# EAGLE design magchess2 (EAGLE 9.3.0)
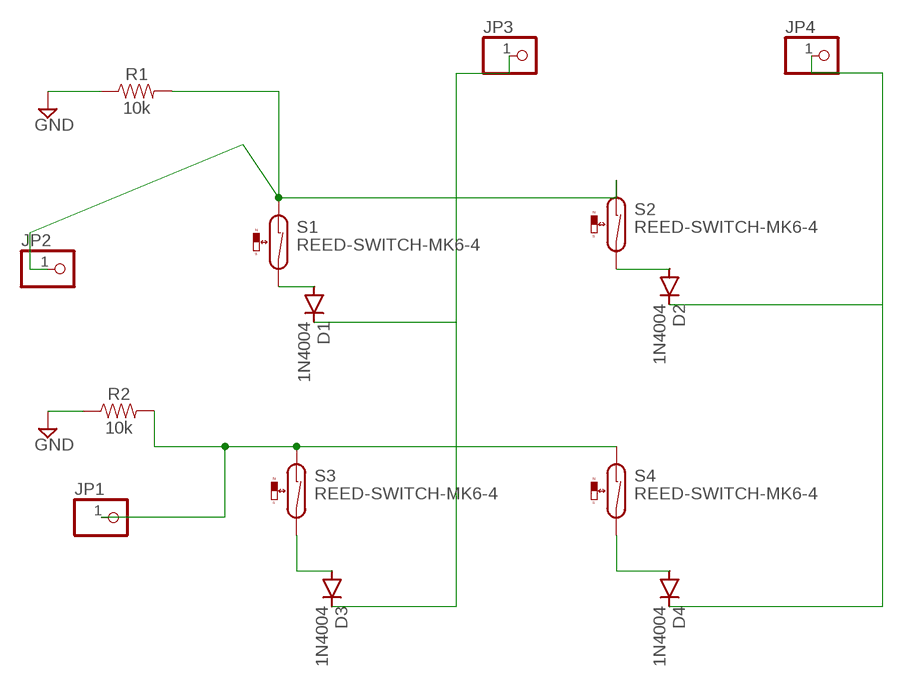
[diagram p0: schematic, sheet 1]

## Parts
D1  1N4004  [DO41-10]
D2  1N4004  [DO41-10]
D3  1N4004  [DO41-10]
D4  1N4004  [DO41-10]
JP1  PINHD-1X1  [1X01]
JP2  PINHD-1X1  [1X01]
JP3  PINHD-1X1  [1X01]
JP4  PINHD-1X1  [1X01]
R1  10k  10KOHM-HORIZ-1/4W-5%  [AXIAL-0.3]
R2  10k  10KOHM-HORIZ-1/4W-5%  [AXIAL-0.3]
S1  REED-SWITCH-MK6-4  [MK6-4]
S2  REED-SWITCH-MK6-4  [MK6-4]
S3  REED-SWITCH-MK6-4  [MK6-4]
S4  REED-SWITCH-MK6-4  [MK6-4]

## Nets
GND: R1.P$1 R2.P$1
N$1: JP2.1 R1.P$2 S1.1 S2.1
N$2: JP1.1 R2.P$2 S3.1 S4.1
N$3: D1.A S1.2
N$4: D3.A S3.2
N$5: D4.A S4.2
N$6: D2.A S2.2
N$7: D2.C D4.C JP4.1
N$8: D1.C D3.C JP3.1

## Library data of the parts
D1-D4 = diode:1N4004: DIODE general purpose rectifier, 1 A
JP1-JP4 = pinhead:PINHD-1X1: PIN HEADER
R1 R2 = SparkFun-Resistors:10KOHM: 10kΩ resistor A resistor is a passive two-terminal electrical component that implements electrical resistance as a circuit element. Resistors act to reduce current flow, and, at the same time, act to lower voltage levels within circuits. - Wikipedia; PROD_ID: RES-09435
S1-S4 = switch-reed:REED-SWITCH-: Reed Sensor; OC_FARNELL: unknown

## Net classes
0 default: width 0.406 mm, clearance 0.406 mm

## Board
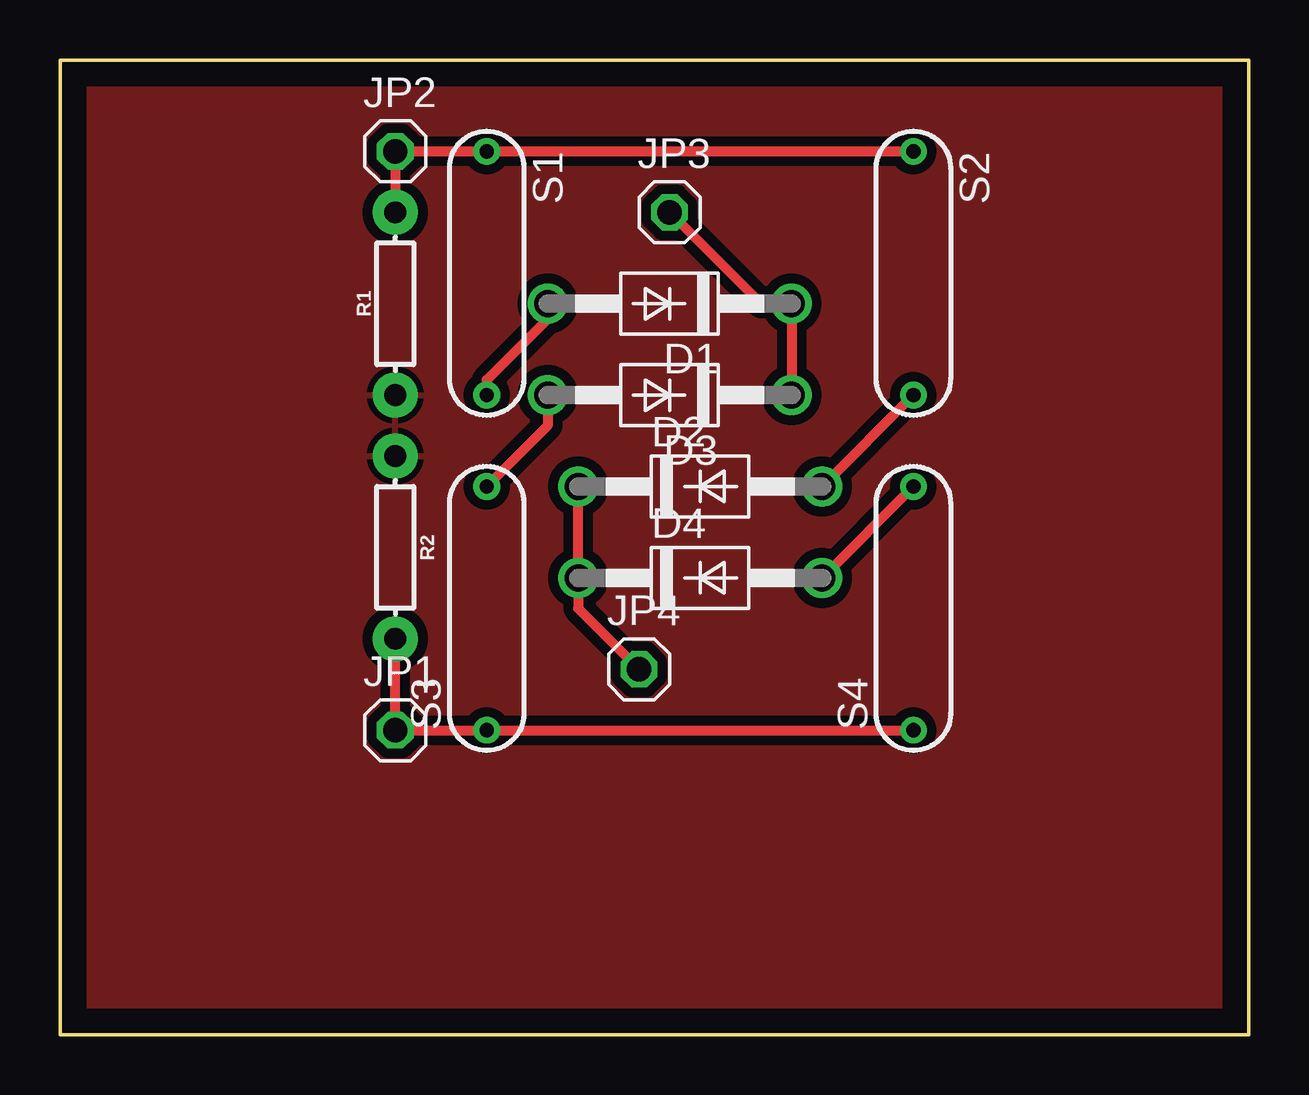
[diagram p1: board, top side]

Size 49.53 x 40.64 mm. Coordinates in mm from the lower left corner, seen from the top.
Outline: 0,40.64 49.53,40.64 49.53,0 0,0 0,40.64
Copper layers (1*16): Top 0.035mm / dielectric 1.5mm / Bottom 0.035mm
Design rules "default *": minimum track width 6mil, minimum drill 0.35mm, track to track 12mil, track to pad 12mil, pad to pad 12mil, via to via 12mil, smd to smd 6mil, copper to edge 40mil, drill to drill 12mil, minimum pad ring 10mil, minimum via ring 8mil, stop-mask expansion 4mil, vias tented up to drill 0mil, thermal gap 10mil

### Footprints (pad centres in the part's own frame; a part is rotated, then mirrored left to right if it is on the bottom)
DO41-10 = drill 1.118: A 5.08,0; C -5.08,0
1X01 = drill 1.016 octagon: 1 0,0
AXIAL-0.3 = drill 0.9 pad 1.88: P$1 -3.81,0; P$2 3.81,0
MK6-4 = drill 0.6 pad 1.016: 1 -5.08,0; 2 5.08,0

### Placement (x,y rotation side)
D1  25.4,30.48 180 top
D2  26.67,22.86 0 top
D3  25.4,26.67 180 top
D4  26.67,19.05 0 top
JP1  13.97,12.7 0 top
JP2  13.97,36.83 0 top
JP3  25.4,34.29 0 top
JP4  24.13,15.24 0 top
R1  13.97,30.48 90 top
R2  13.97,20.32 270 top
S1  17.78,31.75 270 top
S2  35.56,31.75 270 top
S3  17.78,17.78 90 top
S4  35.56,17.78 90 top

### Tracks (layer width: path | path; a pad name or v marks a point on that pad's centre or on a via)
GND
  pour Top: -11.43,59.69 -11.43,-8.89 66.04,-8.89 66.04,57.15 0,57.15 0,59.69
N$1
  Top 0.406: S2.1 S1.1 JP2.1 R1.P$2
N$2
  Top 0.406: S4.1 S3.1 JP1.1 R2.P$2
N$3
  Top 0.406: S1.2 17.78,27.3 20.32,29.84 D1.A
N$4
  Top 0.406: S3.2 20.32,25.4 D3.A
N$5
  Top 0.406: D4.A S4.2
N$6
  Top 0.406: D2.A S2.2
N$7
  Top 0.406: JP4.1 21.59,17.78 D4.C D2.C
N$8
  Top 0.406: JP3.1 29.21,30.48 D1.C D3.C